# Altium schematic sheet uC_Alimentacion.SchDoc: Microcontrolador - Alimentación
size A4; Author: **; CompanyName: Introducción al Diseño de Circuitos Impresos; Organization: UTN FRBA; DocumentNumber: 3; Revision: 01; SheetNumber: 3; SheetTotal: 9; Autor: Eugenia Ipar
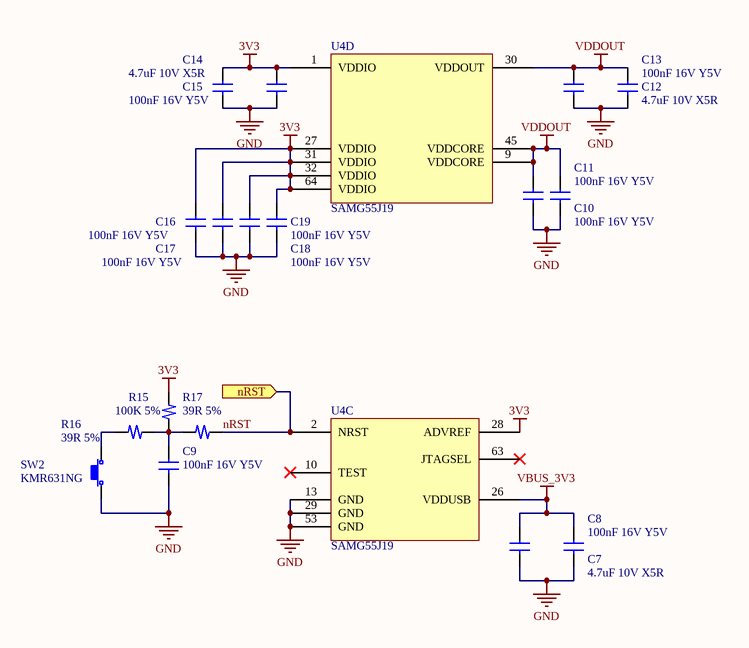
[diagram p0: uC_Alimentacion.SchDoc]

## Parts
C7  4.7uF 10V X5R  [C_0402]
C8  100nF 16V Y5V  [C_0402]
C9  100nF 16V Y5V  [C_0402]
C10  100nF 16V Y5V  [C_0402]
C11  100nF 16V Y5V  [C_0402]
C12  4.7uF 10V X5R  [C_0402]
C13  100nF 16V Y5V  [C_0402]
C14  4.7uF 10V X5R  [C_0402]
C15  100nF 16V Y5V  [C_0402]
C16  100nF 16V Y5V  [C_0402]
C17  100nF 16V Y5V  [C_0402]
C18  100nF 16V Y5V  [C_0402]
C19  100nF 16V Y5V  [C_0402]
R15  100K 5%  [R_0402]
R16  39R 5%  [R_0402]
R17  39R 5%  [R_0402]
SW2  KMR631NG  [TACT SWITCH]
U4  SAMG55J19  [LQFP 64]  (parts C,D of 4)

## Ports
nRST (in)

## Nets
3V3: C14.1 C15.1 C16.1 C17.1 C18.1 C19.1 R15.2 U4.1(VDDIO) U4.27(VDDIO) U4.28(ADVREF) U4.31(VDDIO) U4.32(VDDIO) U4.64(VDDIO)
GND: C7.2 C8.2 C9.2 C10.2 C11.2 C12.2 C13.2 C14.2 C15.2 C16.2 C17.2 C18.2 C19.2 SW2.1 U4.13(GND) U4.29(GND) U4.53(GND)
VBUS_3V3: C7.1 C8.1 U4.26(VDDUSB)
VDDOUT: C10.1 C11.1 C12.1 C13.1 U4.9(VDDCORE) U4.30(VDDOUT) U4.45(VDDCORE)
nRST: R17.2 U4.2(NRST) ; port nRST
NetC9_1: C9.1 R15.1 R16.2 R17.1
NetR16_1: R16.1 SW2.2

Not connected (* = marked no-connect by the designer): U4 10(TEST)* 63(JTAGSEL)*

## Notes on the sheet
- Title:
- Size:
- Author:
- A4
- Sheet
- of
- Revision:
- File:
- Date:

## Library data of the parts
C7-C19 = Ceramic Capacitor: Ceramic Capacitor SMD 0402
R15-R17 = Resistor: Resistor SMD 0402
SW2 = Tact Switch
U4 = SAMG55J19: Atmel SMART SAM G55 Cortex M4 32-bit 64-lead LQFP